# Altium project Pi_Sense.PrjPcb
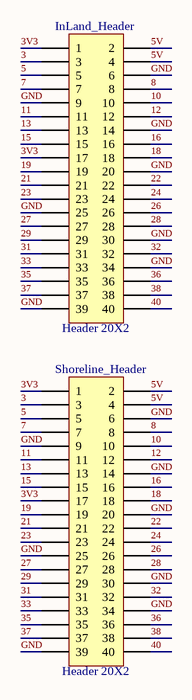
[diagram p0: RasPi_Hat_Temp.SchDoc]
1 sheet, 2 parts. Net scope: global (net labels, ports and power ports of the same name join across sheets).
Board file: RasPi_Hat_Temp.PcbDoc

## Sheet RasPi_Hat_Temp.SchDoc
size A4

### Parts
InLand_Header  Header 20X2  [HDR2X20]
Shoreline_Header  Header 20X2  [HDR2X20]

### Nets
3: InLand_Header.3 Shoreline_Header.3
3V3: InLand_Header.1 InLand_Header.17 Shoreline_Header.1 Shoreline_Header.17
5: InLand_Header.5 Shoreline_Header.5
5V: InLand_Header.2 InLand_Header.4 Shoreline_Header.2 Shoreline_Header.4
7: InLand_Header.7 Shoreline_Header.7
8: InLand_Header.8 Shoreline_Header.8
10: InLand_Header.10 Shoreline_Header.10
11: InLand_Header.11 Shoreline_Header.11
12: InLand_Header.12 Shoreline_Header.12
13: InLand_Header.13 Shoreline_Header.13
15: InLand_Header.15 Shoreline_Header.15
16: InLand_Header.16 Shoreline_Header.16
18: InLand_Header.18 Shoreline_Header.18
19: InLand_Header.19 Shoreline_Header.19
21: InLand_Header.21 Shoreline_Header.21
22: InLand_Header.22 Shoreline_Header.22
23: InLand_Header.23 Shoreline_Header.23
24: InLand_Header.24 Shoreline_Header.24
26: InLand_Header.26 Shoreline_Header.26
27: InLand_Header.27 Shoreline_Header.27
28: InLand_Header.28 Shoreline_Header.28
29: InLand_Header.29 Shoreline_Header.29
31: InLand_Header.31 Shoreline_Header.31
32: InLand_Header.32 Shoreline_Header.32
33: InLand_Header.33 Shoreline_Header.33
35: InLand_Header.35 Shoreline_Header.35
36: InLand_Header.36 Shoreline_Header.36
37: InLand_Header.37 Shoreline_Header.37
38: InLand_Header.38 Shoreline_Header.38
40: InLand_Header.40 Shoreline_Header.40
GND: InLand_Header.6 InLand_Header.9 InLand_Header.14 InLand_Header.20 InLand_Header.25 InLand_Header.30 InLand_Header.34 InLand_Header.39 Shoreline_Header.6 Shoreline_Header.9 Shoreline_Header.14 Shoreline_Header.20 Shoreline_Header.25 Shoreline_Header.30 Shoreline_Header.34 Shoreline_Header.39

### Library data of the parts
InLand_Header Shoreline_Header = Header 20X2: Header, 20-Pin, Dual row; LatestRevisionDate: 17-Jul-2002; LatestRevisionNote: Re-released for DXP Platform.; Publisher: Altium Limited